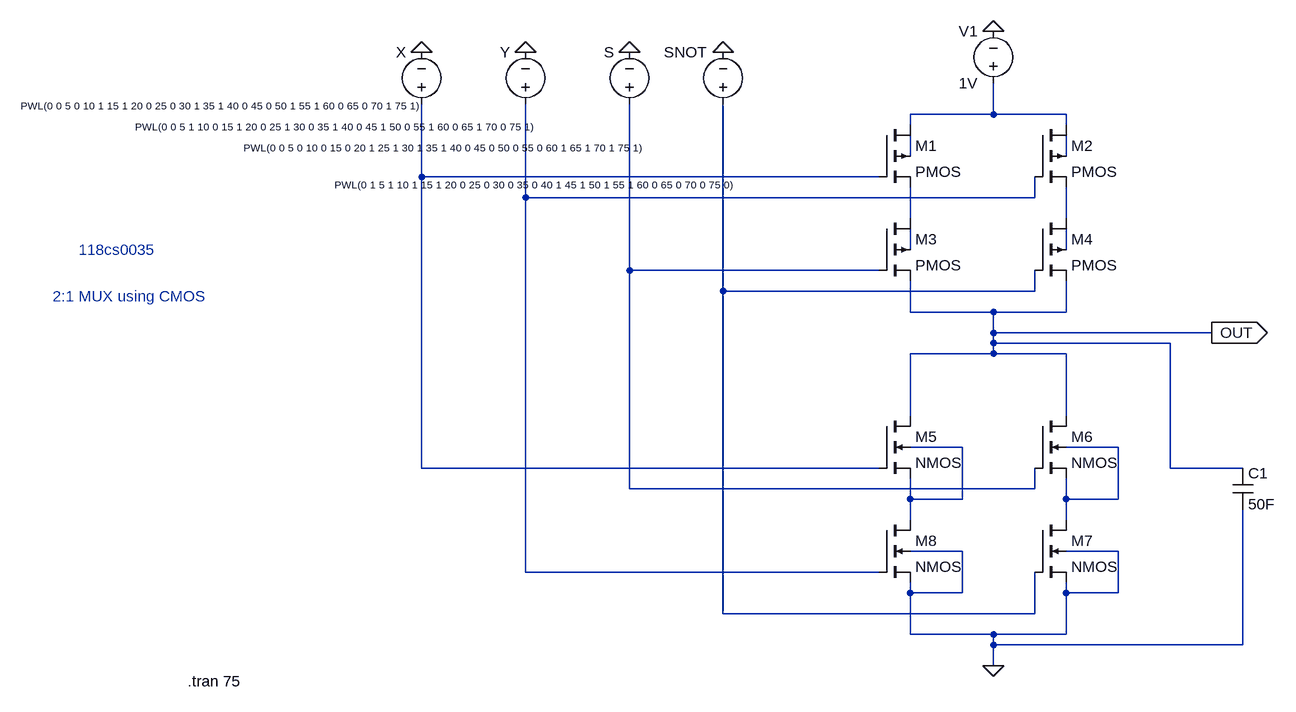
[diagram p0: schematic Draft8.asc]
Draft8.asc, the LTspice schematic file:
Version 4
SHEET 1 880 952
WIRE 288 64 288 16
WIRE 288 64 160 64
WIRE 400 64 288 64
WIRE 160 80 160 64
WIRE 400 80 400 64
WIRE 160 128 160 96
WIRE 400 128 400 96
WIRE -592 160 -592 48
WIRE 112 160 -592 160
WIRE -432 192 -432 48
WIRE 352 192 352 160
WIRE 352 192 -432 192
WIRE 160 224 160 176
WIRE 400 224 400 176
WIRE 160 272 160 240
WIRE 400 272 400 240
WIRE -272 304 -272 48
WIRE 112 304 -272 304
WIRE -128 336 -128 48
WIRE 352 336 352 304
WIRE 352 336 -128 336
WIRE 160 368 160 320
WIRE 288 368 160 368
WIRE 400 368 400 320
WIRE 400 368 288 368
WIRE 288 400 288 368
WIRE 624 400 288 400
WIRE 288 416 288 400
WIRE 560 416 288 416
WIRE 288 432 288 416
WIRE 288 432 160 432
WIRE 400 432 288 432
WIRE 160 528 160 432
WIRE 400 528 400 432
WIRE 240 576 160 576
WIRE 480 576 400 576
WIRE -592 608 -592 160
WIRE 112 608 -592 608
WIRE 560 608 560 416
WIRE 672 608 560 608
WIRE -272 640 -272 304
WIRE 352 640 352 608
WIRE 352 640 -272 640
WIRE 160 656 160 624
WIRE 240 656 240 576
WIRE 240 656 160 656
WIRE 400 656 400 624
WIRE 480 656 480 576
WIRE 480 656 400 656
WIRE 160 688 160 656
WIRE 400 688 400 656
WIRE 240 736 160 736
WIRE 480 736 400 736
WIRE -432 768 -432 192
WIRE 112 768 -432 768
WIRE 160 800 160 784
WIRE 240 800 240 736
WIRE 240 800 160 800
WIRE 400 800 400 784
WIRE 480 800 480 736
WIRE 480 800 400 800
WIRE -128 832 -128 336
WIRE 352 832 352 768
WIRE 352 832 -128 832
WIRE 160 864 160 800
WIRE 288 864 160 864
WIRE 400 864 400 800
WIRE 400 864 288 864
WIRE 288 880 288 864
WIRE 672 880 672 672
WIRE 672 880 288 880
WIRE 288 912 288 880
FLAG 288 -64 0
FLAG 624 400 OUT
IOPIN 624 400 Out
FLAG 288 912 0
FLAG -592 -32 0
FLAG -432 -32 0
FLAG -272 -32 0
FLAG -128 -32 0
SYMBOL pmos4 112 80 R0
SYMATTR InstName M1
SYMBOL pmos4 352 80 R0
SYMATTR InstName M2
SYMBOL pmos4 112 224 R0
SYMATTR InstName M3
SYMBOL pmos4 352 224 R0
SYMATTR InstName M4
SYMBOL voltage 288 32 R180
WINDOW 0 24 96 Left 2
WINDOW 3 24 16 Left 2
SYMATTR InstName V1
SYMATTR Value 1V
SYMBOL nmos4 112 528 R0
SYMATTR InstName M5
SYMBOL nmos4 352 528 R0
SYMATTR InstName M6
SYMBOL nmos4 352 688 R0
SYMATTR InstName M7
SYMBOL nmos4 112 688 R0
SYMATTR InstName M8
SYMBOL voltage -592 64 R180
WINDOW 0 24 96 Left 2
WINDOW 3 18 13 Left 1
WINDOW 123 0 0 Left 0
WINDOW 39 0 0 Left 0
SYMATTR InstName X
SYMATTR Value PWL(0 0 5 0 10 1 15 1 20 0 25 0 30 1 35 1 40 0 45 0 50 1 55 1 60 0 65 0 70 1 75 1)
SYMBOL voltage -432 64 R180
WINDOW 0 24 96 Left 2
WINDOW 3 2 -19 Left 1
WINDOW 123 0 0 Left 0
WINDOW 39 0 0 Left 0
SYMATTR InstName Y
SYMATTR Value PWL(0 0 5 1 10 0 15 1 20 0 25 1 30 0 35 1 40 0 45 1 50 0 55 1 60 0 65 1 70 0 75 1)
SYMBOL voltage -272 64 R180
WINDOW 0 24 96 Left 2
WINDOW 3 -5 -51 Left 1
WINDOW 123 0 0 Left 0
WINDOW 39 0 0 Left 0
SYMATTR InstName S
SYMATTR Value PWL(0 0 5 0 10 0 15 0 20 1 25 1 30 1 35 1 40 0 45 0 50 0 55 0 60 1 65 1 70 1 75 1)
SYMBOL voltage -128 64 R180
WINDOW 0 24 96 Left 2
WINDOW 3 -1 -108 Left 1
WINDOW 123 0 0 Left 0
WINDOW 39 0 0 Left 0
SYMATTR InstName SNOT
SYMATTR Value PWL(0 1 5 1 10 1 15 1 20 0 25 0 30 0 35 0 40 1 45 1 50 1 55 1 60 0 65 0 70 0 75 0)
SYMBOL cap 656 608 R0
SYMATTR InstName C1
SYMATTR Value 50F
TEXT -952 936 Left 2 !.tran 75
TEXT -1120 272 Left 2 ;118cs0035
TEXT -1160 344 Left 2 ;2:1 MUX using CMOS

The netlist it stands for:
* Draft8.asc
M1 N001 N004 N006 N002 PMOS
M2 N001 N005 N007 N003 PMOS
M3 N006 N010 OUT N008 PMOS
M4 N007 N011 OUT N009 PMOS
V1 N001 0 1V
M5 OUT N004 N012 N012 NMOS
M6 OUT N010 N013 N013 NMOS
M7 N013 N011 0 0 NMOS
M8 N012 N005 0 0 NMOS
V§X N004 0 PWL(0 0 5 0 10 1 15 1 20 0 25 0 30 1 35 1 40 0 45 0 50 1 55 1 60 0 65 0 70 1 75 1)
V§Y N005 0 PWL(0 0 5 1 10 0 15 1 20 0 25 1 30 0 35 1 40 0 45 1 50 0 55 1 60 0 65 1 70 0 75 1)
V§S N010 0 PWL(0 0 5 0 10 0 15 0 20 1 25 1 30 1 35 1 40 0 45 0 50 0 55 0 60 1 65 1 70 1 75 1)
V§SNOT N011 0 PWL(0 1 5 1 10 1 15 1 20 0 25 0 30 0 35 0 40 1 45 1 50 1 55 1 60 0 65 0 70 0 75 0)
C1 OUT 0 50F
.model NMOS NMOS
.model PMOS PMOS
.lib standard.mos
.tran 75
* 118cs0035
* 2:1 MUX using CMOS
.backanno
.end